# Altium schematic sheet ESP32-LORA_RA_08H.SchDoc
size 420 x 297 mm; Author: Nguyễn Huy Hoàng; SheetNumber: 4; SheetTotal: 5; Instructor: Nguyễn Trung Hiếu
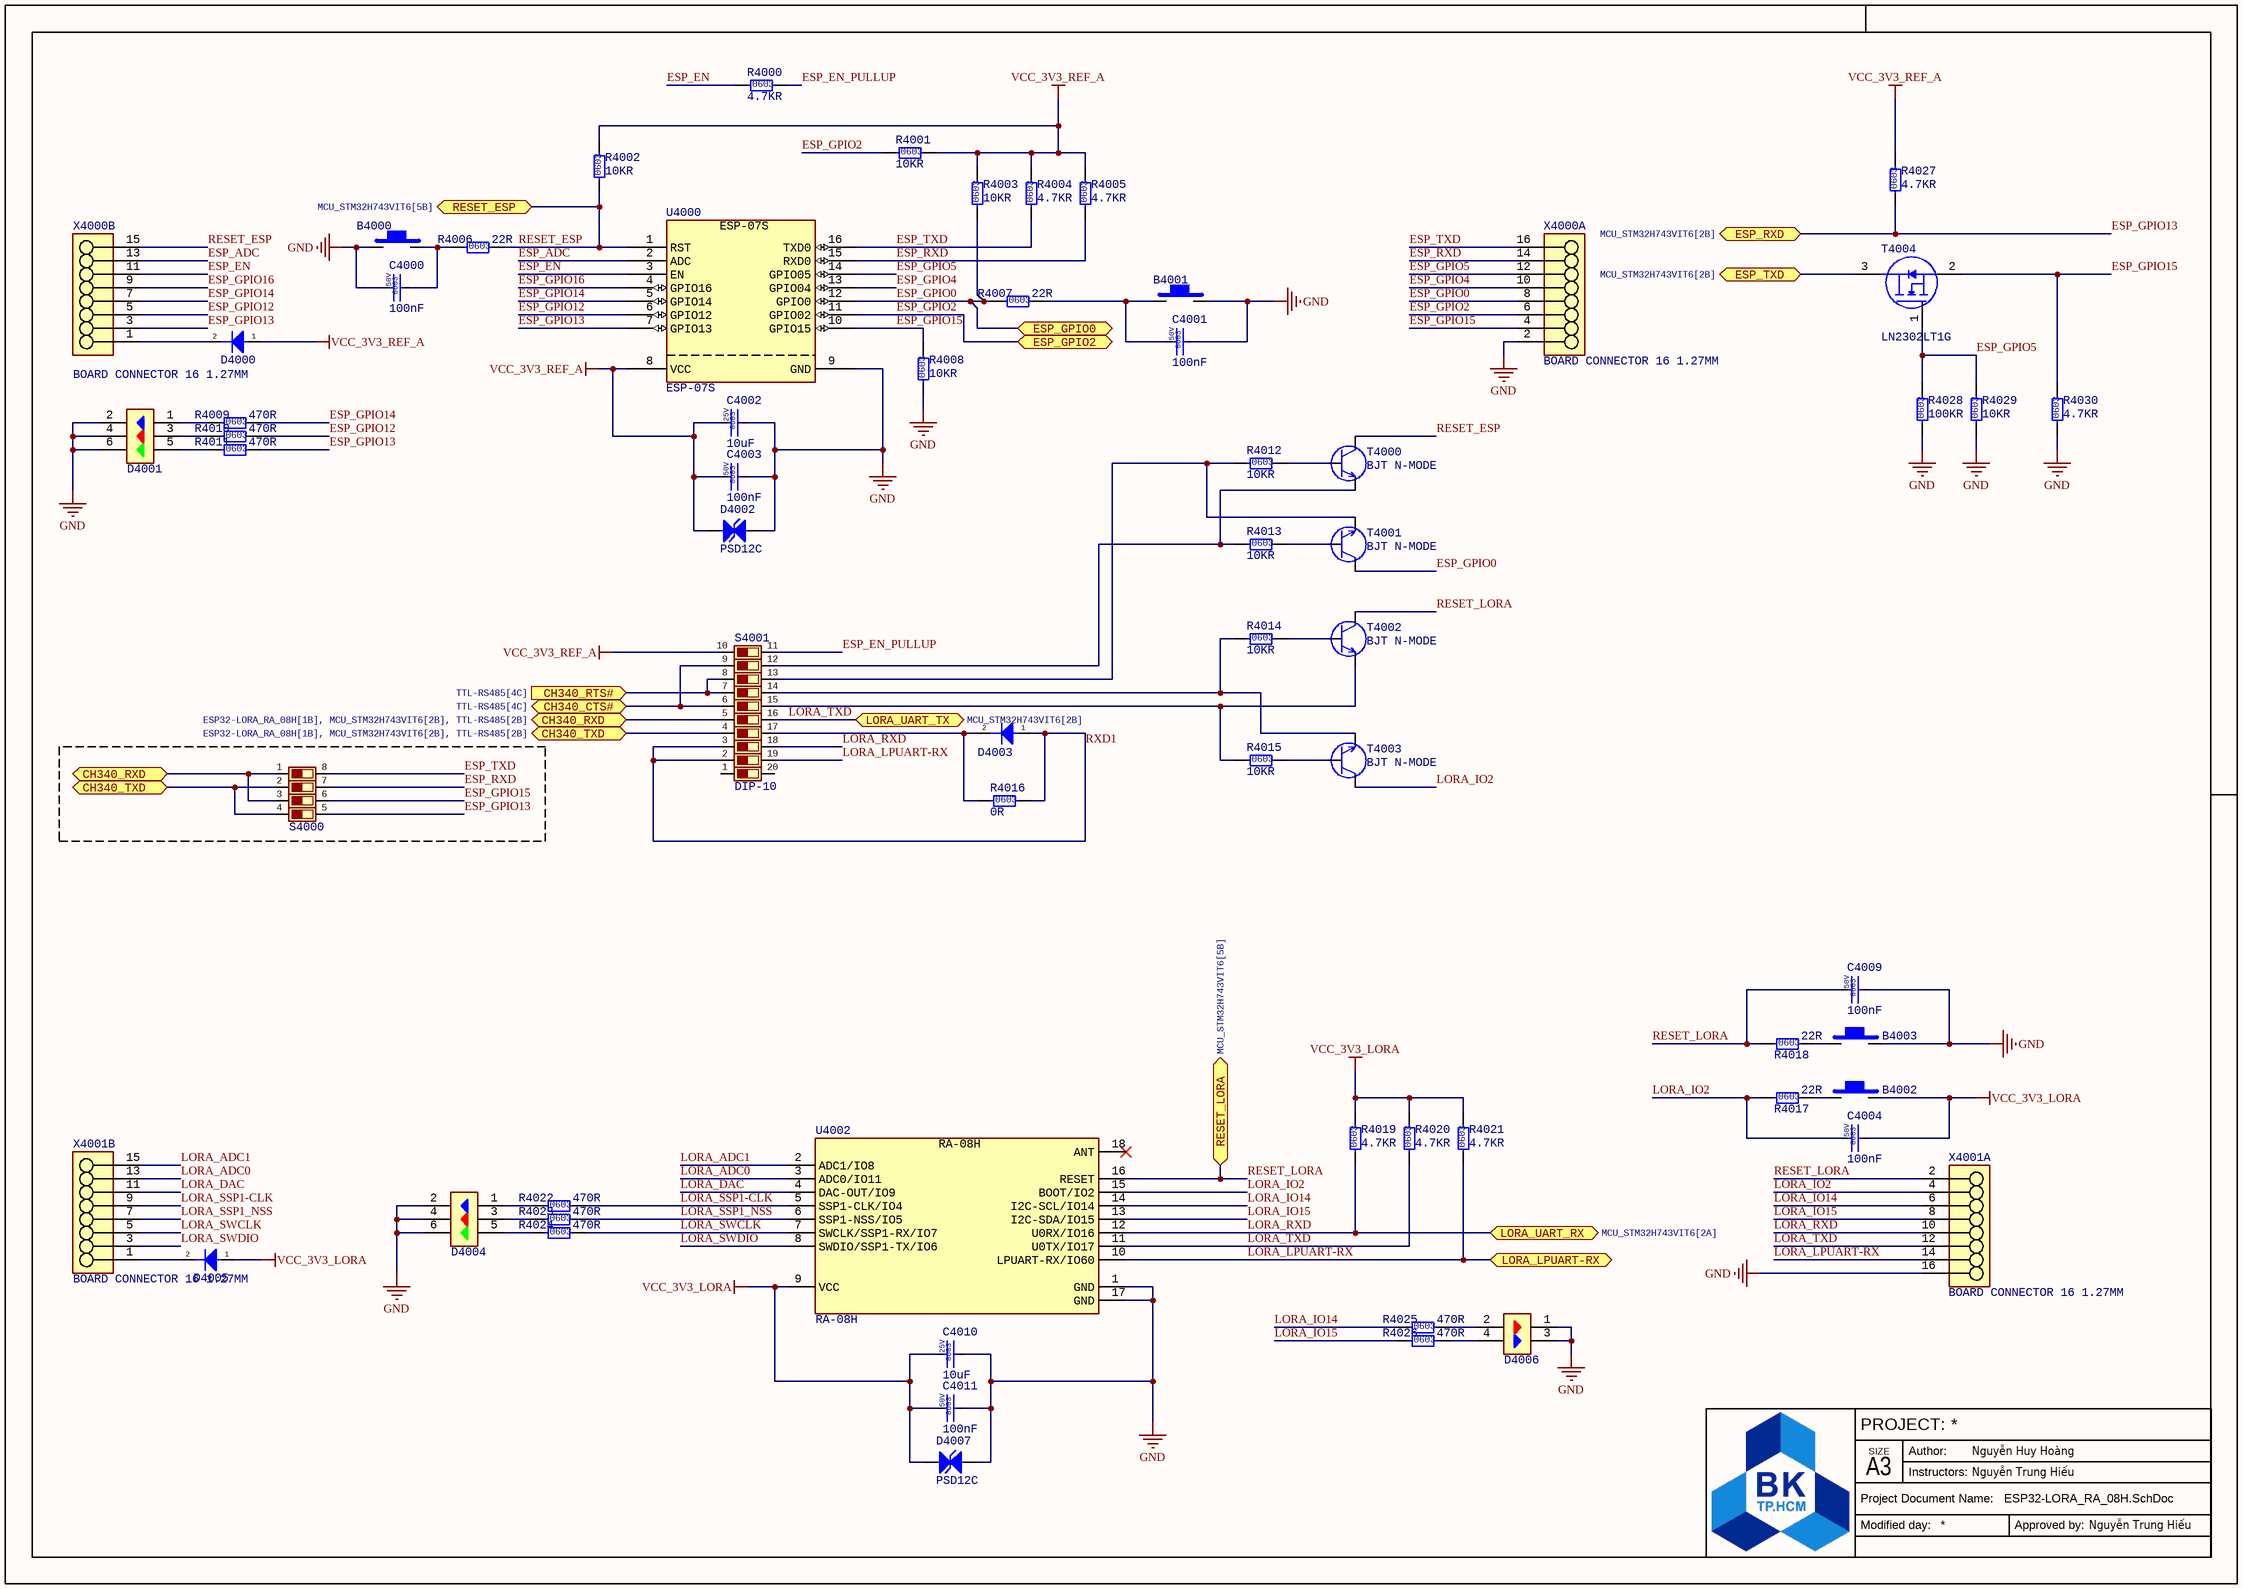
[diagram p0: ESP32-LORA_RA_08H.SchDoc]

## Parts
B4000  TACTILE 3X4MM  [TACTILE 3X4MM]  (value not drawn)
B4001  TACTILE 3X4MM  [TACTILE 3X4MM]  (value not drawn)
B4002  TACTILE 3X4MM  [TACTILE 3X4MM]  (value not drawn)
B4003  TACTILE 3X4MM  [TACTILE 3X4MM]  (value not drawn)
C4000  100nF  Voltage: 50V  Size: 0603  [CAP CER 0603]
C4001  100nF  Voltage: 50V  Size: 0603  [CAP CER 0603]
C4002  10uF  Voltage: 25V  Size: 0603  [CAP CER 0603]
C4003  100nF  Voltage: 50V  Size: 0603  [CAP CER 0603]
C4004  100nF  Voltage: 50V  Size: 0603  [CAP CER 0603]
C4009  100nF  Voltage: 50V  Size: 0603  [CAP CER 0603]
C4010  10uF  Voltage: 25V  Size: 0603  [CAP CER 0603]
C4011  100nF  Voltage: 50V  Size: 0603  [CAP CER 0603]
D4000  1N4148W-E3-18  [SOD-123]  (value not drawn)
D4001  LED RGB 5050  [LED RGB 5050]  (value not drawn)
D4002  PSD12C  [SOD-323]
D4003  1N4148W-E3-18  [SOD-123]  (value not drawn)
D4004  LED RGB 5050  [LED RGB 5050]  (value not drawn)
D4005  1N4148W-E3-18  [SOD-123]  (value not drawn)
D4006  LED R/B 0805  [LED RB 0805]  (value not drawn)
D4007  PSD12C  [SOD-323]
R4000  4.7KR  Size: 0603  [RESC 0603(1608) SMD]
R4001  10KR  Size: 0603  [RESC 0603(1608) SMD]
R4002  10KR  Size: 0603  [RESC 0603(1608) SMD]
R4003  10KR  Size: 0603  [RESC 0603(1608) SMD]
R4004  4.7KR  Size: 0603  [RESC 0603(1608) SMD]
R4005  4.7KR  Size: 0603  [RESC 0603(1608) SMD]
R4006  22R  Size: 0603  [RESC 0603(1608) SMD]
R4007  22R  Size: 0603  [RESC 0603(1608) SMD]
R4008  10KR  Size: 0603  [RESC 0603(1608) SMD]
R4009  470R  Size: 0603  [RESC 0603(1608) SMD]
R4010  470R  Size: 0603  [RESC 0603(1608) SMD]
R4011  470R  Size: 0603  [RESC 0603(1608) SMD]
R4012  10KR  Size: 0603  [RESC 0603(1608) SMD]
R4013  10KR  Size: 0603  [RESC 0603(1608) SMD]
R4014  10KR  Size: 0603  [RESC 0603(1608) SMD]
R4015  10KR  Size: 0603  [RESC 0603(1608) SMD]
R4016  0R  Size: 0603  [RESC 0603(1608) SMD]
R4017  22R  Size: 0603  [RESC 0603(1608) SMD]
R4018  22R  Size: 0603  [RESC 0603(1608) SMD]
R4019  4.7KR  Size: 0603  [RESC 0603(1608) SMD]
R4020  4.7KR  Size: 0603  [RESC 0603(1608) SMD]
R4021  4.7KR  Size: 0603  [RESC 0603(1608) SMD]
R4022  470R  Size: 0603  [RESC 0603(1608) SMD]
R4023  470R  Size: 0603  [RESC 0603(1608) SMD]
R4024  470R  Size: 0603  [RESC 0603(1608) SMD]
R4025  470R  Size: 0603  [RESC 0603(1608) SMD]
R4026  470R  Size: 0603  [RESC 0603(1608) SMD]
R4027  4.7KR  Size: 0603  [RESC 0603(1608) SMD]
R4028  100KR  Size: 0603  [RESC 0603(1608) SMD]
R4029  10KR  Size: 0603  [RESC 0603(1608) SMD]
R4030  4.7KR  Size: 0603  [RESC 0603(1608) SMD]
S4000  DIP-4  [DIP-4 SWITCH]  (value not drawn)
S4001  DIP-10  [DIP-10 SWITCH]
T4000  BJT N-MODE  [SOT23-3]
T4001  BJT N-MODE  [SOT23-3]
T4002  BJT N-MODE  [SOT23-3]
T4003  BJT N-MODE  [SOT23-3]
T4004  LN2302LT1G  [SOT23-3]
U4000  ESP-07S  [ESP-07S]
U4002  RA-08H  [RA-08H]
X4000  BOARD CONNECTOR 16 1.27MM  [BOARD CONNECTOR 16 1.27MM]  (parts A,B of 2)
X4001  BOARD CONNECTOR 16 1.27MM  [BOARD CONNECTOR 16 1.27MM]  (parts A,B of 2)

## Ports
CH340_CTS# (bidir, see TTL-RS485[4C]), CH340_RTS# (in, see TTL-RS485[4C]), CH340_RXD (bidir, see ESP32-LORA_RA_08H[1B], MCU_STM32H743VIT6[2B], TTL-RS485[2B]), CH340_RXD (bidir, see ESP32-LORA_RA_08H[2B], MCU_STM32H743VIT6[2B], TTL-RS485[2B]), CH340_TXD (bidir, see ESP32-LORA_RA_08H[1B], MCU_STM32H743VIT6[2B], TTL-RS485[2B]), CH340_TXD (bidir, see ESP32-LORA_RA_08H[2B], MCU_STM32H743VIT6[2B], TTL-RS485[2B]), ESP_GPIO0 (bidir), ESP_GPIO2 (bidir), ESP_RXD (bidir, see MCU_STM32H743VIT6[2B]), ESP_TXD (bidir, see MCU_STM32H743VIT6[2B]), LORA_LPUART-RX (bidir), LORA_UART_RX (bidir, see MCU_STM32H743VIT6[2A]), LORA_UART_TX (bidir, see MCU_STM32H743VIT6[2B]), RESET_ESP (bidir, see MCU_STM32H743VIT6[5B]), RESET_LORA (bidir, see MCU_STM32H743VIT6[5B])

## Nets
GND: B4000.1 B4001.2 B4003.2 C4000.1 C4001.2 C4002.2 C4003.2 C4009.2 C4010.2 C4011.2 D4001.2 D4001.4 D4001.6 D4002.2 D4004.2 D4004.4 D4004.6 D4006.1 D4006.3 D4007.2 R4008.1 R4028.1 R4029.1 R4030.1 U4000.9(GND) U4002.1(GND) U4002.17(GND) X4000.2 X4001.16
VCC_3V3_LORA: B4002.2 C4004.2 C4010.1 C4011.1 D4005.1(A) D4007.1 R4019.2 R4020.2 R4021.2 U4002.9(VCC)
VCC_3V3_REF_A: C4002.1 C4003.1 D4000.1(A) D4002.1 R4001.2 R4002.2 R4003.2 R4004.2 R4005.2 R4027.2 S4001.10 U4000.8(VCC)
CH340_CTS#: S4001.6 S4001.9 ; port CH340_CTS#
CH340_RTS#: S4001.7 S4001.8 ; port CH340_RTS#
CH340_RXD: S4000.1 S4000.3 S4001.5 ; port CH340_RXD
CH340_TXD: S4000.2 S4000.4 S4001.4 ; port CH340_TXD
ESP_ADC: U4000.2(ADC) X4000.13
ESP_EN: R4000.1 U4000.3(EN) X4000.11
ESP_EN_PULLUP: R4000.2 S4001.11
ESP_GPIO0: R4003.1 R4007.1 T4001.3 U4000.12(GPIO0) X4000.8 ; port ESP_GPIO0
ESP_GPIO2: R4001.1 U4000.11(GPIO02) X4000.6 ; port ESP_GPIO2
ESP_GPIO4: U4000.13(GPIO04) X4000.10
ESP_GPIO5: R4028.2 R4029.2 T4004.1(G) U4000.14(GPIO05) X4000.12
ESP_GPIO12: R4010.2 U4000.6(GPIO12) X4000.5
ESP_GPIO13: R4011.2 R4027.1 S4000.5 U4000.7(GPIO13) X4000.3 ; port ESP_RXD
ESP_GPIO14: R4009.2 U4000.5(GPIO14) X4000.7
ESP_GPIO15: R4008.2 R4030.2 S4000.6 T4004.2(S) U4000.10(GPIO15) X4000.4
ESP_GPIO16: U4000.4(GPIO16) X4000.9
ESP_RXD: R4005.1 S4000.7 U4000.15(RXD0) X4000.14
ESP_TXD: R4004.1 S4000.8 U4000.16(TXD0) X4000.16
ESP_TXD: T4004.3(D) ; port ESP_TXD  [a separate net that carries the same name]
LORA_ADC0: U4002.3(ADC0/IO11) X4001.13
LORA_ADC1: U4002.2(ADC1/IO8) X4001.15
LORA_DAC: U4002.4(DAC-OUT/IO9) X4001.11
LORA_IO2: C4004.1 R4017.1 T4003.3 U4002.15(BOOT/IO2) X4001.4
LORA_IO14: R4025.1 U4002.14(I2C-SCL/IO14) X4001.6
LORA_IO15: R4026.1 U4002.13(I2C-SDA/IO15) X4001.8
LORA_LPUART-RX: R4021.1 S4001.19 U4002.10(LPUART-RX/IO60) X4001.14 ; port LORA_LPUART-RX
LORA_RXD: R4019.1 S4001.18 U4002.12(U0RX/IO16) X4001.10 ; port LORA_UART_RX
LORA_SSP1-CLK: R4022.2 U4002.5(SSP1-CLK/IO4) X4001.9
LORA_SSP1_NSS: R4023.2 U4002.6(SSP1-NSS/IO5) X4001.7
LORA_SWCLK: R4024.2 U4002.7(SWCLK/SSP1-RX/IO7) X4001.5
LORA_SWDIO: U4002.8(SWDIO/SSP1-TX/IO6) X4001.3
LORA_TXD: R4020.1 S4001.16 U4002.11(U0TX/IO17) X4001.12 ; port LORA_UART_TX
RESET_ESP: R4002.1 R4006.2 T4000.3 U4000.1(RST) X4000.15 ; port RESET_ESP
RESET_LORA: C4009.1 R4018.1 T4002.3 U4002.16(RESET) X4001.2 ; port RESET_LORA
RXD1: D4003.1(A) R4016.2 S4001.2 S4001.3
NetB4000_2: B4000.2 C4000.2 R4006.1
NetB4001_1: B4001.1 C4001.1 R4007.2
NetB4002_1: B4002.1 R4017.2
NetB4003_1: B4003.1 R4018.2
NetD4000_2: D4000.2(K) X4000.1
NetD4001_1: D4001.1 R4009.1
NetD4001_3: D4001.3 R4010.1
NetD4001_5: D4001.5 R4011.1
NetD4003_2: D4003.2(K) R4016.1 S4001.17
NetD4004_1: D4004.1 R4022.1
NetD4004_3: D4004.3 R4023.1
NetD4004_5: D4004.5 R4024.1
NetD4005_2: D4005.2(K) X4001.1
NetD4006_2: D4006.2 R4025.2
NetD4006_4: D4006.4 R4026.2
NetR4012_1: R4012.1 S4001.13 T4001.2
NetR4012_2: R4012.2 T4000.1
NetR4013_1: R4013.1 S4001.12 T4000.2
NetR4013_2: R4013.2 T4001.1
NetR4014_1: R4014.1 S4001.14 T4003.2
NetR4014_2: R4014.2 T4002.1
NetR4015_1: R4015.1 S4001.15 T4002.2
NetR4015_2: R4015.2 T4003.1

Not connected (* = marked no-connect by the designer): S4001 1 20; U4002 18(ANT)*

## Notes on the sheet
- PROJECT:
- SIZE
- Author:
- Instructors:
- Project Document Name:
- Modified day:
- A3
- Approved by:

## Library data of the parts
B4000-B4003 = FF-3007: Nút Nhấn 3x4mm Cao 2.5mm 2 Chân SMD; Design Item ID: FF-3007; Type: BUTTON; TH/SMD: SMD; Value: N/A; Tolerance: N/A; Voltage: N/A; Power Rate: N/A; Size: 3X4MM; Supplier: THEGIOIIC; Supplier Part Number: Nút Nhấn 3x4mm Cao 2.5mm 2 Chân SMD; Supplier Link: https://www.thegioiic.com/nut-nhan-3x4mm-cao-2-5mm-2-chan-smd
C4000 C4001 C4003 C4004 C4009 C4011 = FF-1008: CAP CER SMD 100nF 10% 50V 0603; Type: CAP CER; Design Item ID: FF-1008; TH/SMD: SMD; Value: 100nF; Tolerance: 10%; Power Rate: N/A; Supplier: THEGIOIIC; Supplier Part Number: 10%, 0603 (1608 Metric); Supplier Link: https://www.thegioiic.com/tu-gom-0603-100nf-0-1uf-50v
C4002 C4010 = FF-1021: CAP CER SMD 10uF 10% 25V 0603; Type: CAP CER; Design Item ID: FF-1021; TH/SMD: SMD; Value: 10uF; Tolerance: 10%; Power Rate: N/A; Supplier: THEGIOIIC; Supplier Part Number: 10%, 0603 (1608 Metric); Supplier Link: https://www.thegioiic.com/tu-gom-0603-10uf-25v
D4000 D4003 D4005 = FF-4016: Diode Standard 75V 150mA; TH/SMD: SMD; Design Item ID: FF-4016; Type: DIODE; Value: 75V 150mA; Tolerance: N/A; Voltage: 75V; Power Rate: N/A; Size: SOD-123; Supplier: THEGIOIIC; Supplier Part Number: 1N4148W-E3-18; Supplier Link: https://www.thegioiic.com/1n4148w-e3-18-diode-gen-purp-75v-150ma-sod123
D4001 D4004 = FF-4018: LED RGB 5050 Dán SMD Trong Suốt; Value: 5 x 5 x 1.5mm; Design Item ID: FF-4018; Type: LED RGB; TH/SMD: SMD; Tolerance: N/A; Voltage: N/A; Power Rate: N/A; Size: 5050; Supplier: THEGIOIIC; Supplier Part Number: LED RGB 5050 Dán SMD Trong Suốt; Supplier Link: https://www.thegioiic.com/led-rgb-5050-dan-smd-trong-suot
D4002 D4007 = FF-4015: Package SOD323, Diode TVS, 50pF, 29.5V; TH/SMD: SMD; Design Item ID: FF-4015; Type: TVS DIODE; Value: 50 pF, 29.5V; Tolerance: N/A; Voltage: 29.5V; Power Rate: N/A; Size: SOD-323; Supplier: THEGIOIIC; Supplier Part Number: PSD12C; Supplier Link: https://www.thegioiic.com/psd12c
D4006 = FF-4019: LED 2 Màu Đỏ, Xanh Dương 0805 Dán SMD Trong Suốt; Type: LED R/B; Value: 0805; Design Item ID: FF-4019; TH/SMD: SMD; Tolerance: N/A; Voltage: N/A; Power Rate: N/A; Size: 0805; Supplier: THEGIOIIC; Supplier Part Number: LED 2 Màu Đỏ, Xanh Dương 0805 Dán SMD Trong Suốt; Supplier Link: https://www.thegioiic.com/led-2-mau-do-xanh-duong-0805-dan-smd-trong-suot
R4000 R4004 R4005 R4019-R4021 R4027 R4030 = FF-0016: RESISTOR SMD 4.7KR OHM 1% 100mW 0603; Power Rate: 100mW; Design Item ID: FF-0016; Type: RESISTOR; TH/SMD: SMD; Value: 4.7KR; Tolerance: 1%; Voltage: N/A; Supplier: THEGIOIIC; Supplier Part Number: 472, 1/10W; Supplier Link: https://www.thegioiic.com/dien-tro-4-7-kohm-0603-1-
R4001-R4003 R4008 R4012-R4015 R4029 = FF-0020: RESISTOR SMD 10KR OHM 1% 100mW 0603; Power Rate: 100mW; Design Item ID: FF-0020; Type: RESISTOR; TH/SMD: SMD; Value: 10KR; Tolerance: 1%; Voltage: N/A; Supplier: THEGIOIIC; Supplier Part Number: 103, 1/10W; Supplier Link: https://www.thegioiic.com/dien-tro-10-kohm-0603-1-
R4006 R4007 R4017 R4018 = FF-0049: RESISTOR SMD 22R OHM 1% 100mW 0603; Power Rate: 100mW; Design Item ID: FF-0049; Type: RESISTOR; TH/SMD: SMD; Value: 22R; Tolerance: 1%; Voltage: N/A; Supplier: THEGIOIIC; Supplier Part Number: 22R (Code 220), 1/10W; Supplier Link: https://www.thegioiic.com/dien-tro-22-ohm-0603-1-
R4009-R4011 R4022-R4026 = FF-0050: RESISTOR SMD 470R OHM 1% 100mW 0603; Power Rate: 100mW; Design Item ID: FF-0050; Type: RESISTOR; TH/SMD: SMD; Value: 470R; Tolerance: 1%; Voltage: N/A; Supplier: THEGIOIIC; Supplier Part Number: Code 471, 1/10W; Supplier Link: https://www.thegioiic.com/dien-tro-470-ohm-0603-1-
R4016 = FF-0003: RESISTOR SMD 0R OHM 1% 100mW 0603; Power Rate: 100mW; Design Item ID: FF-0003; Type: RESISTOR; TH/SMD: SMD; Value: 0R; Tolerance: 1%; Voltage: N/A; Supplier: THEGIOIIC; Supplier Part Number: 0R0, 1/10W; Supplier Link: https://www.thegioiic.com/dien-tro-0-ohm-0603-1-
R4028 = FF-0029: RESISTOR SMD 100KR OHM 1% 100mW 0603; Power Rate: 100mW; Design Item ID: FF-0029; Type: RESISTOR; TH/SMD: SMD; Value: 100KR; Tolerance: 1%; Voltage: N/A; Supplier: THEGIOIIC; Supplier Part Number: 104, 1/10W; Supplier Link: https://www.thegioiic.com/dien-tro-100-kohm-0603-1-
S4000 = FF-3011: DIP SWITCH 1.27mm 4PIN; TH/SMD: SMD; Design Item ID: FF-3011; Type: SWITCH; Value: N/A; Tolerance: N/A; Voltage: N/A; Power Rate: N/A; Size: 4 X 1.27mm; Supplier: THEGIOIIC; Supplier Part Number: Công Tắc DIP Switch Dán SMD 1 Bit 1.27mm; Supplier Link: https://www.thegioiic.com/cong-tac-dip-switch-dan-smd-4-bit-1-27mm
S4001 = FF-3013: DIP SWITCH 1.27mm 10PIN; TH/SMD: SMD; Design Item ID: FF-3013; Type: SWITCH; Value: N/A; Tolerance: N/A; Voltage: N/A; Power Rate: N/A; Size: 10 X 1.27mm; Supplier: THEGIOIIC; Supplier Part Number: Công Tắc DIP Switch Dán SMD 10 Bit 1.27mm; Supplier Link: https://www.thegioiic.com/cong-tac-dip-switch-dan-smd-10-bit-1-27mm
T4000-T4003 = FF-4024: 2SC1815-HF Transistor NPN 50V 0.15A; TH/SMD: SMD; Design Item ID: FF-4024; Type: Transistor; Value: N/A; Tolerance: N/A; Voltage: 50V; Power Rate: 0.15A; Size: SOT23-3; Supplier: THEGIOIIC; Supplier Part Number: 2SC1815-HF Transistor NPN 50V 0.15A 3 Chân SOT-23; Supplier Link: https://www.thegioiic.com/2sc1815-hf-transistor-npn-50v-0-15a-3-chan-sot-23
T4004 = FF-4001: 20V N-Channel Enhancement-Mode MOSFET; Type: TRANSISTOR; TH/SMD: SMD; Value: 20V-2.8A-N; Design Item ID: FF-4001; Tolerance: N/A; Voltage: 20V; Power Rate: N/A; Size: SOT23-3; Supplier: THEGIOIIC; Supplier Part Number: LN2302LT1G; Supplier Link: https://www.thegioiic.com/ln2302lt1g-mosfet-kenh-n
U4000 = FF-2018: ESP-07S WiFi module; TH/SMD: SMD; Design Item ID: FF-2018; Type: MODULE; Value: ESP-07S; Tolerance: N/A; Voltage: N/A; Power Rate: N/A; Size: ESP-07S; Supplier: THEGIOIIC; Supplier Part Number: ESP-07S AI-Thinker ESP8266 Mạch Thu Phát WiFi; Supplier Link: https://www.thegioiic.com/esp-07s-ai-thinker-esp8266-mach-thu-phat-wifi
U4002 = FF-2019: 803 - 930MHz LORAWAN MODULE; TH/SMD: SMD; Design Item ID: FF-2019; Type: MODULE; Value: RA-08H; Tolerance: N/A; Voltage: N/A; Power Rate: N/A; Size: RA-08H; Supplier: N/A; Supplier Part Number: N/A; Supplier Link: N/A
X4000 X4001 = FF-3008: Hàng Rào Đực Đôi 1.27mm 60 Chân 2 hàng SMD; Design Item ID: FF-3008; Type: CONNECTOR; TH/SMD: SMD; Value: N/A; Tolerance: N/A; Voltage: N/A; Power Rate: N/A; Size: 2 X 1.27mm; Supplier: THEGIOIIC; Supplier Part Number: Hàng Rào Đực Đôi 1.27mm 60 Chân 2 hàng SMD; Supplier Link: https://www.thegioiic.com/hang-rao-duc-doi-1-27mm-60-chan-2-hang-smd